# Altium schematic sheet POWER.SchDoc
size A4
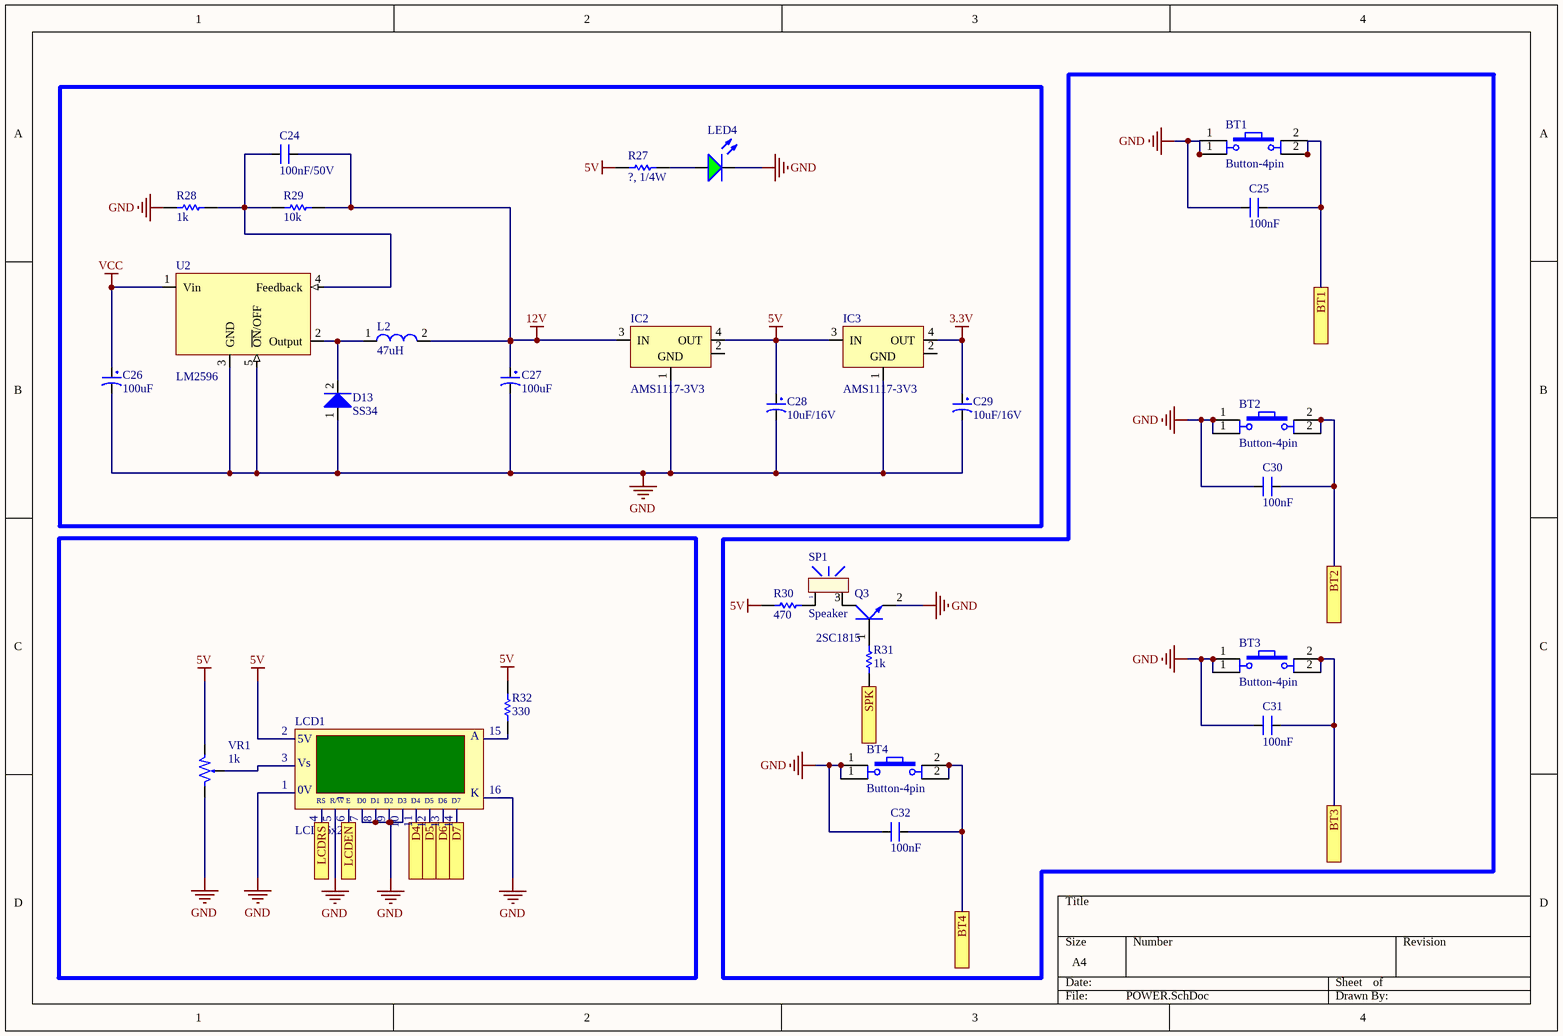
[diagram p0: POWER.SchDoc]

## Parts
BT1  Button-4pin  [Button 12x12x7.3mm]
BT2  Button-4pin  [Button 12x12x7.3mm]
BT3  Button-4pin  [Button 12x12x7.3mm]
BT4  Button-4pin  [Button 12x12x7.3mm]
C24  100nF/50V  [RES 0603(1508)]
C25  100nF  [CAP 0603(1508)]
C26  100uF  [CAP_ALU_SIZED8]
C27  100uF  [CAP_ALU_SIZED8]
C28  10uF/16V  [CAP_TAN_1206(3216)]
C29  10uF/16V  [CAP_TAN_1206(3216)]
C30  100nF  [CAP 0603(1508)]
C31  100nF  [CAP 0603(1508)]
C32  100nF  [CAP 0603(1508)]
D13  SS34  [SS34]
IC2  AMS1117-3V3  [AMS1117]
IC3  AMS1117-3V3  [AMS1117]
L2  47uH  [Inductor SMD 48x48x28mm]
LCD1  LCD16x2  [LCD16x2]
LED4  LED_GREEN  [LED0805GREEN]  (value not drawn)
Q3  2SC1815  [2SC1815-SMD]
R27  ?, 1/4W  [RES 0603(1508)]
R28  1k  [RES 0603(1508)]
R29  10k  [RES 0603(1508)]
R30  470  [RES 0603(1508)]
R31  1k  [RES 0603(1508)]
R32  330  [RES 0603(1508)]
SP1  Speaker  [Speaker]
U2  LM2596  [LM2596]
VR1  1k  [Trimmer 3262]

## Ports
BT1, BT2, BT3, BT4, D4, D5, D6, D7, LCDEN, LCDRS, SPK

## Nets
3.3V: C29.1 IC3.4(OUT)
5V: C28.1 IC2.4(OUT) IC3.3(IN) LCD1.2 R27.2 R30.1 R32.1 VR1.1
12V: C24.2 C27.1 IC2.3(IN) L2.2 R29.1
GND: BT1.1 BT2.1 BT3.1 BT4.1 C25.2 C26.2 C27.2 C28.2 C29.2 C30.2 C31.2 C32.2 D13.1(A) IC2.1(GND) IC3.1(GND) LCD1.1 LCD1.5 LCD1.7 LCD1.8 LCD1.9 LCD1.10 LCD1.16 LED4.2(K) Q3.2(E) R28.2 U2.3(GND) U2.5(~{ON}/OFF) VR1.3
VCC: C26.1 U2.1(Vin)
BT1: BT1.2 C25.1 ; port BT1
BT2: BT2.2 C30.1 ; port BT2
BT3: BT3.2 C31.1 ; port BT3
BT4: BT4.2 C32.1 ; port BT4
D4: LCD1.11 ; port D4
D5: LCD1.12 ; port D5
D6: LCD1.13 ; port D6
D7: LCD1.14 ; port D7
LCDEN: LCD1.6 ; port LCDEN
LCDRS: LCD1.4 ; port LCDRS
SPK: R31.1 ; port SPK
NetC24_1: C24.1 R28.1 R29.2 U2.4(Feedback)
NetD13_2: D13.2(K) L2.1 U2.2(Output)
NetLCD1_3: LCD1.3 VR1.2
NetLCD1_15: LCD1.15(VCC) R32.2
NetLED4_1: LED4.1(A) R27.1
NetQ3_1: Q3.1(B) R31.2
NetQ3_3: Q3.3(C) SP1.2
NetR30_2: R30.2 SP1.1

Not connected (* = marked no-connect by the designer): IC2 2(OUT); IC3 2(OUT)

## Notes on the sheet
- (in symbol LCD16x2) A; 5V; Vs; 0V; K; RS; R/W; E; D0; D1; D2; D3; D4; D5; D6; D7

## Library data of the parts
C24 = CAP_CER_100nF_50V_NPOL: Ceramic Capacitor 100nF/50V (+-20% TH)/(+10%SMD)
C25 C30-C32 = CAP_CER_1nF_50V_NPOL: Ceramic Capacitor 1nF/50V (+-20% TH)/(+10%SMD)
C26 C27 = CAP_ALU_100uF_35V_POL_SMD: Aluminum Capacitor 100uF size D
C28 C29 = CAP_TANTA_10uF_16V_POL: Tantalum SMD capacitor 10uF(+-10%),TAJA106K010RNJ
IC2 IC3 = AMS1117-3V3: Linear Voltage Regulator 3.3V 1A 15V Max SOT-223; ComponentLink1Description: Datasheet; ComponentLink1URL: D:\Dropbox\Datasheets\Power Management ICs\Linear Regulators\AMS1117.pdf; Unit Price: 0.2000
L2 = Inductor
LED4 = LED_GREEN: LED Green; ComponentLink1Description: Datasheet; ComponentLink1URL: D:\Dropbox\Datasheets\Opto and Illumination\LEDs\SMD LED.pdf; Unit Price: 0.0476
Q3 = 2SC1815: NPN
R27-R32 = Resistor 1/4W: Resistor through hole 1/4W
SP1 = Speaker: Buzzer through hole (3V3/5V/12V)
U2 = LM2596: Step-Down Switching Regulator 5V 3.0 A 15 V Max
VR1 = Variable Resistor: WH148